# Altium project DQLA-Q.PrjPcb
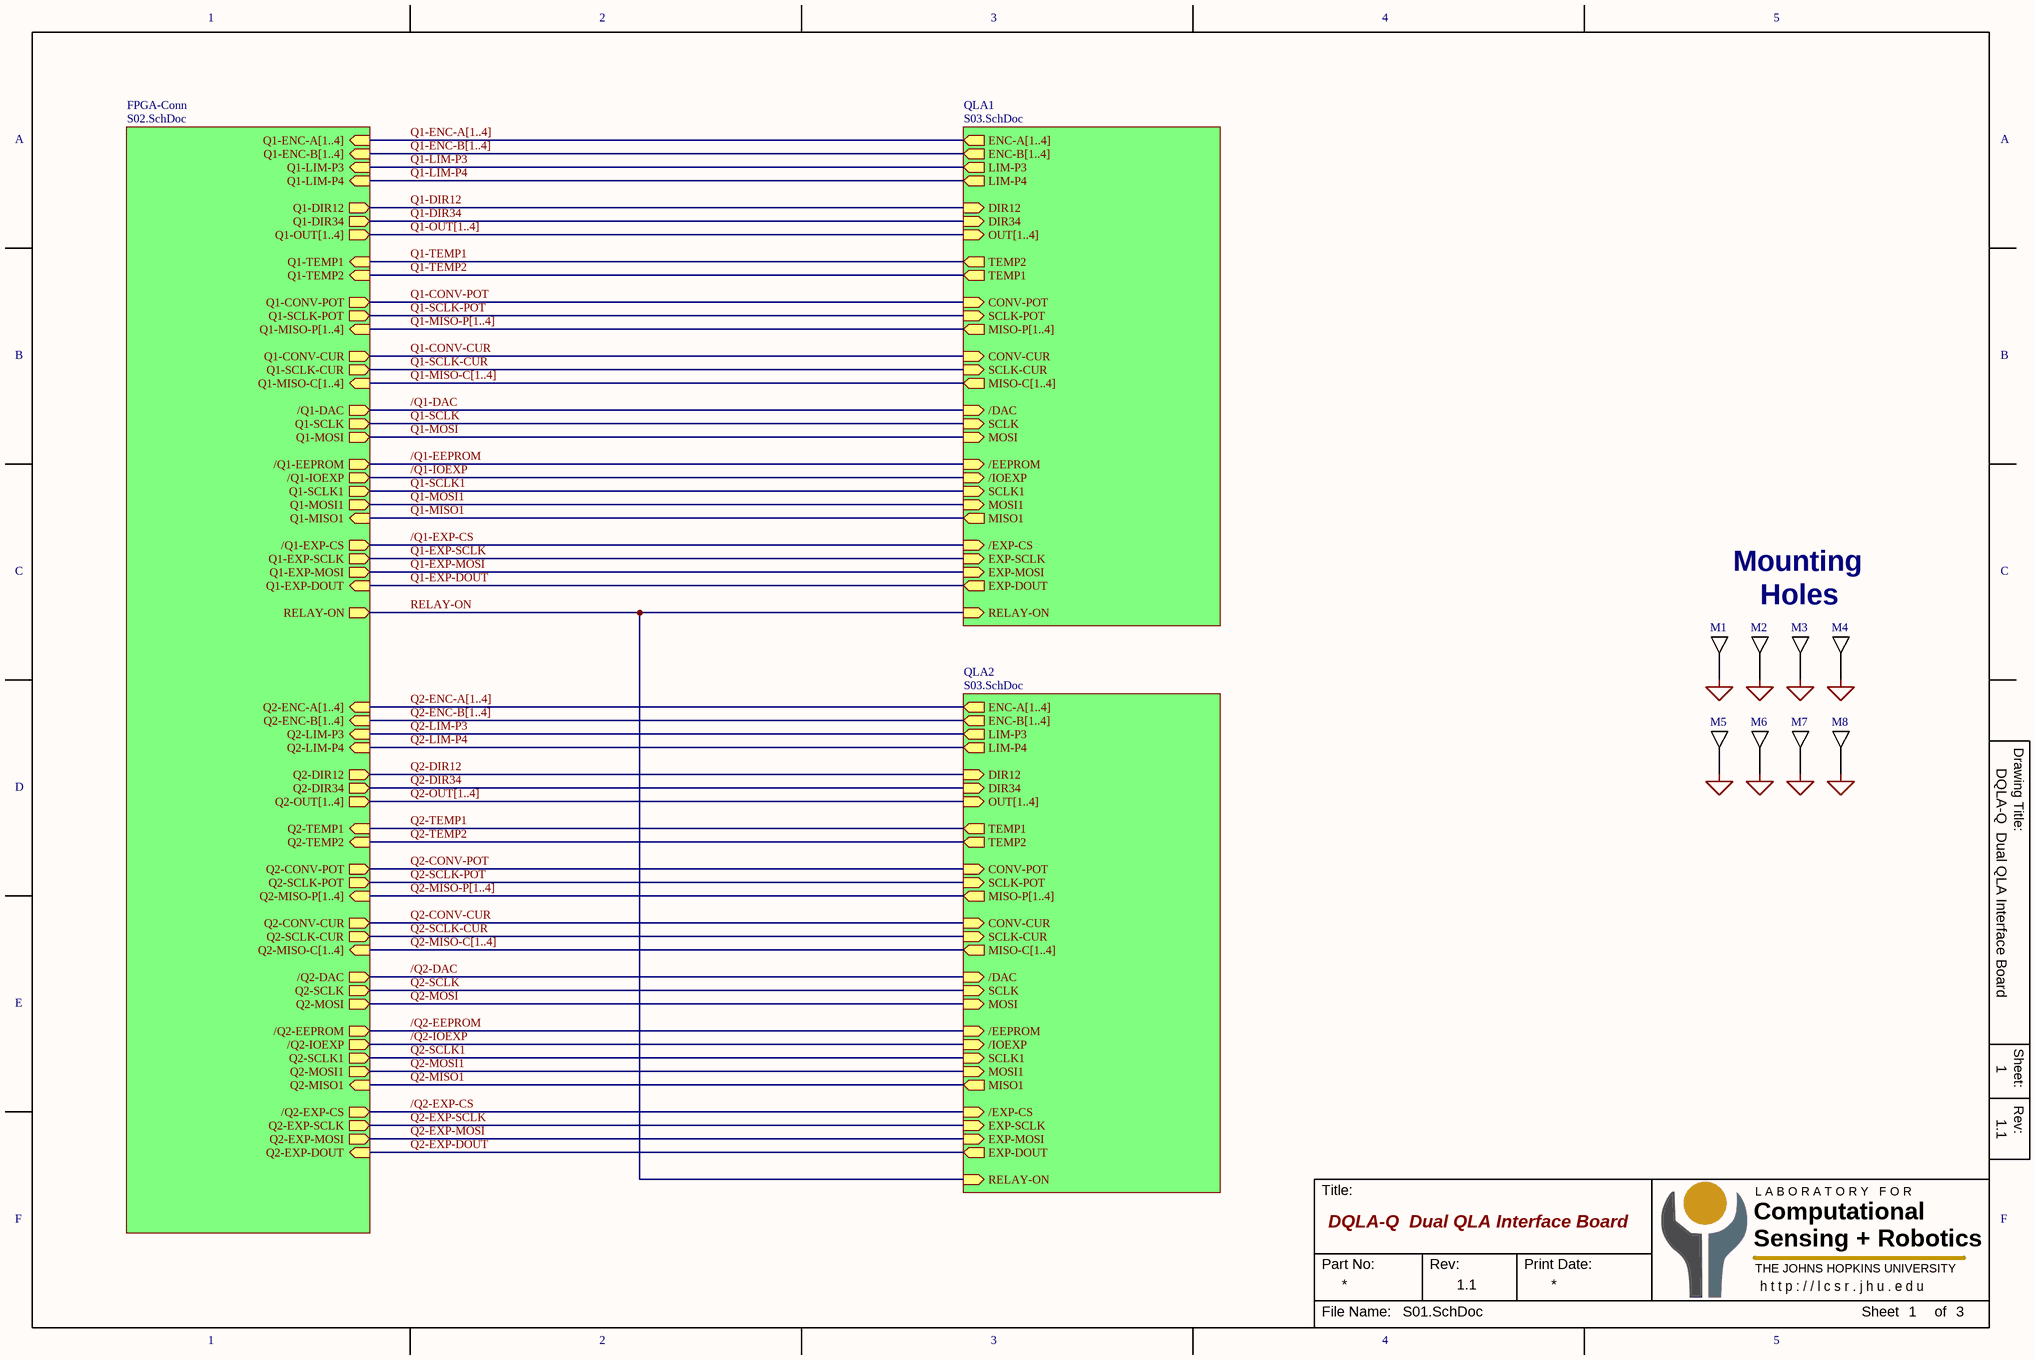
[diagram p0: S01.SchDoc]
3 sheets, 112 parts. Net scope: hierarchical (ports join the sheet entries above them; power ports are global).
Board file: DQLA-Q.PcbDoc
Sheets:
  S01.SchDoc
    FPGA-Conn = S02.SchDoc
    QLA1 = S03.SchDoc
    QLA2 = S03.SchDoc

## Sheet S01.SchDoc: DQLA-Q  Dual QLA Interface Board
size 381 x 254 mm; Revision: 1.1; SheetNumber: 1; SheetTotal: 3

### Parts
M1  MHOLE  [MHOLE4]  (value not drawn)  (no BOM)
M2  MHOLE  [MHOLE4]  (value not drawn)  (no BOM)
M3  MHOLE  [MHOLE4]  (value not drawn)  (no BOM)
M4  MHOLE  [MHOLE4]  (value not drawn)  (no BOM)
M5  MHOLE  [MHOLE4]  (value not drawn)  (no BOM)
M6  MHOLE  [MHOLE4]  (value not drawn)  (no BOM)
M7  MHOLE  [MHOLE4]  (value not drawn)  (no BOM)
M8  MHOLE  [MHOLE4]  (value not drawn)  (no BOM)

### Sub-sheets
FPGA-Conn = S02.SchDoc: Q2-DIR34 (out), Q1-CONV-CUR (out), /Q1-EXP-CS (out), /Q2-EXP-CS (out), Q2-LIM-P4 (in), Q1-DIR12 (out), Q1-LIM-P4 (in), Q1-SCLK-CUR (out), Q1-DIR34 (out), Q2-EXP-DOUT (in), Q1-MOSI1 (out), RELAY-ON (out), Q1-CONV-POT (out), Q1-SCLK-POT (out), Q2-DIR12 (out), Q2-OUT[1..4] (out), Q2-LIM-P3 (in), /Q1-DAC (out), Q1-MISO-P[1..4] (in), Q2-MISO-P[1..4] (in), Q1-LIM-P3 (in), Q1-TEMP2 (in), /Q1-IOEXP (out), /Q1-EEPROM (out), Q2-TEMP2 (in), Q2-TEMP1 (in), /Q2-DAC (out), /Q2-IOEXP (out), Q2-ENC-A[1..4] (in), Q1-MOSI (out), Q1-OUT[1..4] (out), Q1-MISO-C[1..4] (in), /Q2-EEPROM (out), Q2-MISO-C[1..4] (in), Q2-ENC-B[1..4] (in), Q1-ENC-B[1..4] (in), Q2-MOSI (out), Q1-EXP-DOUT (in), Q1-ENC-A[1..4] (in), Q1-TEMP1 (in), Q1-SCLK (out), Q2-CONV-POT (out), Q2-CONV-CUR (out), Q2-SCLK-CUR (out), Q2-SCLK-POT (out), Q2-MOSI1 (out), Q2-SCLK (out), Q2-SCLK1 (out), Q1-SCLK1 (out), Q2-MISO1 (in), Q1-MISO1 (in), Q1-EXP-SCLK (out), Q1-EXP-MOSI (out), Q2-EXP-SCLK (out), Q2-EXP-MOSI (out)
QLA1 = S03.SchDoc: ENC-A[1..4] (out), SCLK-POT (in), RELAY-ON (in), OUT[1..4] (in), EXP-DOUT (out), LIM-P3 (out), CONV-POT (in), ENC-B[1..4] (out), TEMP2 (out), TEMP1 (out), DIR12 (in), SCLK (in), MISO-P[1..4] (out), /EXP-CS (in), MOSI1 (in), EXP-MOSI (in), EXP-SCLK (in), /IOEXP (in), /EEPROM (in), SCLK1 (in), MISO1 (out), LIM-P4 (out), /DAC (in), DIR34 (in), CONV-CUR (in), SCLK-CUR (in), MOSI (in), MISO-C[1..4] (out)
QLA2 = S03.SchDoc: ENC-A[1..4] (out), SCLK-POT (in), RELAY-ON (in), OUT[1..4] (in), EXP-DOUT (out), LIM-P3 (out), CONV-POT (in), ENC-B[1..4] (out), TEMP2 (out), TEMP1 (out), DIR12 (in), SCLK (in), MISO-P[1..4] (out), /EXP-CS (in), MOSI1 (in), EXP-MOSI (in), EXP-SCLK (in), /IOEXP (in), /EEPROM (in), SCLK1 (in), MISO1 (out), LIM-P4 (out), /DAC (in), DIR34 (in), CONV-CUR (in), SCLK-CUR (in), MOSI (in), MISO-C[1..4] (out)

### Nets
GND: M1.1 M2.1 M3.1 M4.1 M5.1 M6.1 M7.1 M8.1
/Q1-DAC: sheet FPGA-Conn//Q1-DAC, sheet QLA1//DAC  [project net /DAC]
/Q1-EEPROM: sheet FPGA-Conn//Q1-EEPROM, sheet QLA1//EEPROM  [project net /EEPROM]
/Q1-EXP-CS: sheet FPGA-Conn//Q1-EXP-CS, sheet QLA1//EXP-CS  [project net /EXP-CS]
/Q1-IOEXP: sheet FPGA-Conn//Q1-IOEXP, sheet QLA1//IOEXP  [project net /IOEXP]
/Q2-DAC: sheet FPGA-Conn//Q2-DAC, sheet QLA2//DAC  [project net /DAC]
/Q2-EEPROM: sheet FPGA-Conn//Q2-EEPROM, sheet QLA2//EEPROM  [project net /EEPROM]
/Q2-EXP-CS: sheet FPGA-Conn//Q2-EXP-CS, sheet QLA2//EXP-CS  [project net /EXP-CS]
/Q2-IOEXP: sheet FPGA-Conn//Q2-IOEXP, sheet QLA2//IOEXP  [project net /IOEXP]
Q1-CONV-CUR: sheet FPGA-Conn/Q1-CONV-CUR, sheet QLA1/CONV-CUR  [project net CONV-CUR]
Q1-CONV-POT: sheet FPGA-Conn/Q1-CONV-POT, sheet QLA1/CONV-POT  [project net CONV-POT]
Q1-DIR12: sheet FPGA-Conn/Q1-DIR12, sheet QLA1/DIR12  [project net DIR12]
Q1-DIR34: sheet FPGA-Conn/Q1-DIR34, sheet QLA1/DIR34  [project net DIR34]
Q1-EXP-DOUT: sheet FPGA-Conn/Q1-EXP-DOUT, sheet QLA1/EXP-DOUT  [project net EXP-DOUT]
Q1-EXP-MOSI: sheet FPGA-Conn/Q1-EXP-MOSI, sheet QLA1/EXP-MOSI  [project net EXP-MOSI]
Q1-EXP-SCLK: sheet FPGA-Conn/Q1-EXP-SCLK, sheet QLA1/EXP-SCLK  [project net EXP-SCLK]
Q1-LIM-P3: sheet FPGA-Conn/Q1-LIM-P3, sheet QLA1/LIM-P3  [project net LIM-P3]
Q1-LIM-P4: sheet FPGA-Conn/Q1-LIM-P4, sheet QLA1/LIM-P4  [project net LIM-P4]
Q1-MISO1: sheet FPGA-Conn/Q1-MISO1, sheet QLA1/MISO1  [project net MISO1]
Q1-MOSI: sheet FPGA-Conn/Q1-MOSI, sheet QLA1/MOSI  [project net MOSI]
Q1-MOSI1: sheet FPGA-Conn/Q1-MOSI1, sheet QLA1/MOSI1  [project net MOSI1]
Q1-SCLK: sheet FPGA-Conn/Q1-SCLK, sheet QLA1/SCLK
Q1-SCLK1: sheet FPGA-Conn/Q1-SCLK1, sheet QLA1/SCLK1
Q1-SCLK-CUR: sheet FPGA-Conn/Q1-SCLK-CUR, sheet QLA1/SCLK-CUR
Q1-SCLK-POT: sheet FPGA-Conn/Q1-SCLK-POT, sheet QLA1/SCLK-POT
Q1-TEMP1: sheet FPGA-Conn/Q1-TEMP1, sheet QLA1/TEMP2
Q1-TEMP2: sheet FPGA-Conn/Q1-TEMP2, sheet QLA1/TEMP1
Q2-CONV-CUR: sheet FPGA-Conn/Q2-CONV-CUR, sheet QLA2/CONV-CUR  [project net CONV-CUR]
Q2-CONV-POT: sheet FPGA-Conn/Q2-CONV-POT, sheet QLA2/CONV-POT  [project net CONV-POT]
Q2-DIR12: sheet FPGA-Conn/Q2-DIR12, sheet QLA2/DIR12  [project net DIR12]
Q2-DIR34: sheet FPGA-Conn/Q2-DIR34, sheet QLA2/DIR34  [project net DIR34]
Q2-EXP-DOUT: sheet FPGA-Conn/Q2-EXP-DOUT, sheet QLA2/EXP-DOUT  [project net EXP-DOUT]
Q2-EXP-MOSI: sheet FPGA-Conn/Q2-EXP-MOSI, sheet QLA2/EXP-MOSI  [project net EXP-MOSI]
Q2-EXP-SCLK: sheet FPGA-Conn/Q2-EXP-SCLK, sheet QLA2/EXP-SCLK  [project net EXP-SCLK]
Q2-LIM-P3: sheet FPGA-Conn/Q2-LIM-P3, sheet QLA2/LIM-P3  [project net LIM-P3]
Q2-LIM-P4: sheet FPGA-Conn/Q2-LIM-P4, sheet QLA2/LIM-P4  [project net LIM-P4]
Q2-MISO1: sheet FPGA-Conn/Q2-MISO1, sheet QLA2/MISO1  [project net MISO1]
Q2-MOSI: sheet FPGA-Conn/Q2-MOSI, sheet QLA2/MOSI  [project net MOSI]
Q2-MOSI1: sheet FPGA-Conn/Q2-MOSI1, sheet QLA2/MOSI1  [project net MOSI1]
Q2-SCLK: sheet FPGA-Conn/Q2-SCLK, sheet QLA2/SCLK
Q2-SCLK1: sheet FPGA-Conn/Q2-SCLK1, sheet QLA2/SCLK1
Q2-SCLK-CUR: sheet FPGA-Conn/Q2-SCLK-CUR, sheet QLA2/SCLK-CUR
Q2-SCLK-POT: sheet FPGA-Conn/Q2-SCLK-POT, sheet QLA2/SCLK-POT
Q2-TEMP1: sheet FPGA-Conn/Q2-TEMP1, sheet QLA2/TEMP1
Q2-TEMP2: sheet FPGA-Conn/Q2-TEMP2, sheet QLA2/TEMP2
RELAY-ON: sheet FPGA-Conn/RELAY-ON, sheet QLA1/RELAY-ON, sheet QLA2/RELAY-ON

### Buses and harness runs
bus Q1-ENC-A[1..4] = sheet FPGA-Conn/Q1-ENC-A[1..4] = sheet QLA1/ENC-A[1..4]
bus Q1-ENC-B[1..4] = sheet FPGA-Conn/Q1-ENC-B[1..4] = sheet QLA1/ENC-B[1..4]
bus Q1-MISO-C[1..4] = sheet FPGA-Conn/Q1-MISO-C[1..4] = sheet QLA1/MISO-C[1..4]
bus Q1-MISO-P[1..4] = sheet FPGA-Conn/Q1-MISO-P[1..4] = sheet QLA1/MISO-P[1..4]
bus Q1-OUT[1..4] = sheet FPGA-Conn/Q1-OUT[1..4] = sheet QLA1/OUT[1..4]
bus Q2-ENC-A[1..4] = sheet FPGA-Conn/Q2-ENC-A[1..4] = sheet QLA2/ENC-A[1..4]
bus Q2-ENC-B[1..4] = sheet FPGA-Conn/Q2-ENC-B[1..4] = sheet QLA2/ENC-B[1..4]
bus Q2-MISO-C[1..4] = sheet FPGA-Conn/Q2-MISO-C[1..4] = sheet QLA2/MISO-C[1..4]
bus Q2-MISO-P[1..4] = sheet FPGA-Conn/Q2-MISO-P[1..4] = sheet QLA2/MISO-P[1..4]
bus Q2-OUT[1..4] = sheet FPGA-Conn/Q2-OUT[1..4] = sheet QLA2/OUT[1..4]

### Notes on the sheet
- To do:
- Mounting
- Holes
- 1
- 2
- 3
- 4
- 5
- A
- B
- C
- Drawing Title:
- D
- E
- Sheet:
- Rev:
- F
- Title:
- Computational
- Sensing + Robotics
- L A B O R A T O R Y   F O R
- Part No:
- Print Date:
- THE JOHNS HOPKINS UNIVERSITY
- h t t p : / / l c s r . j h u . e d u
- File Name:
- Sheet
- of

### Library data of the parts
M1-M8 = MHOLE: Mounting Hole

## Sheet S02.SchDoc: DQLA-Q  Dual QLA Interface Board
size 381 x 254 mm; Revision: 1.1; SheetNumber: 2; SheetTotal: 3
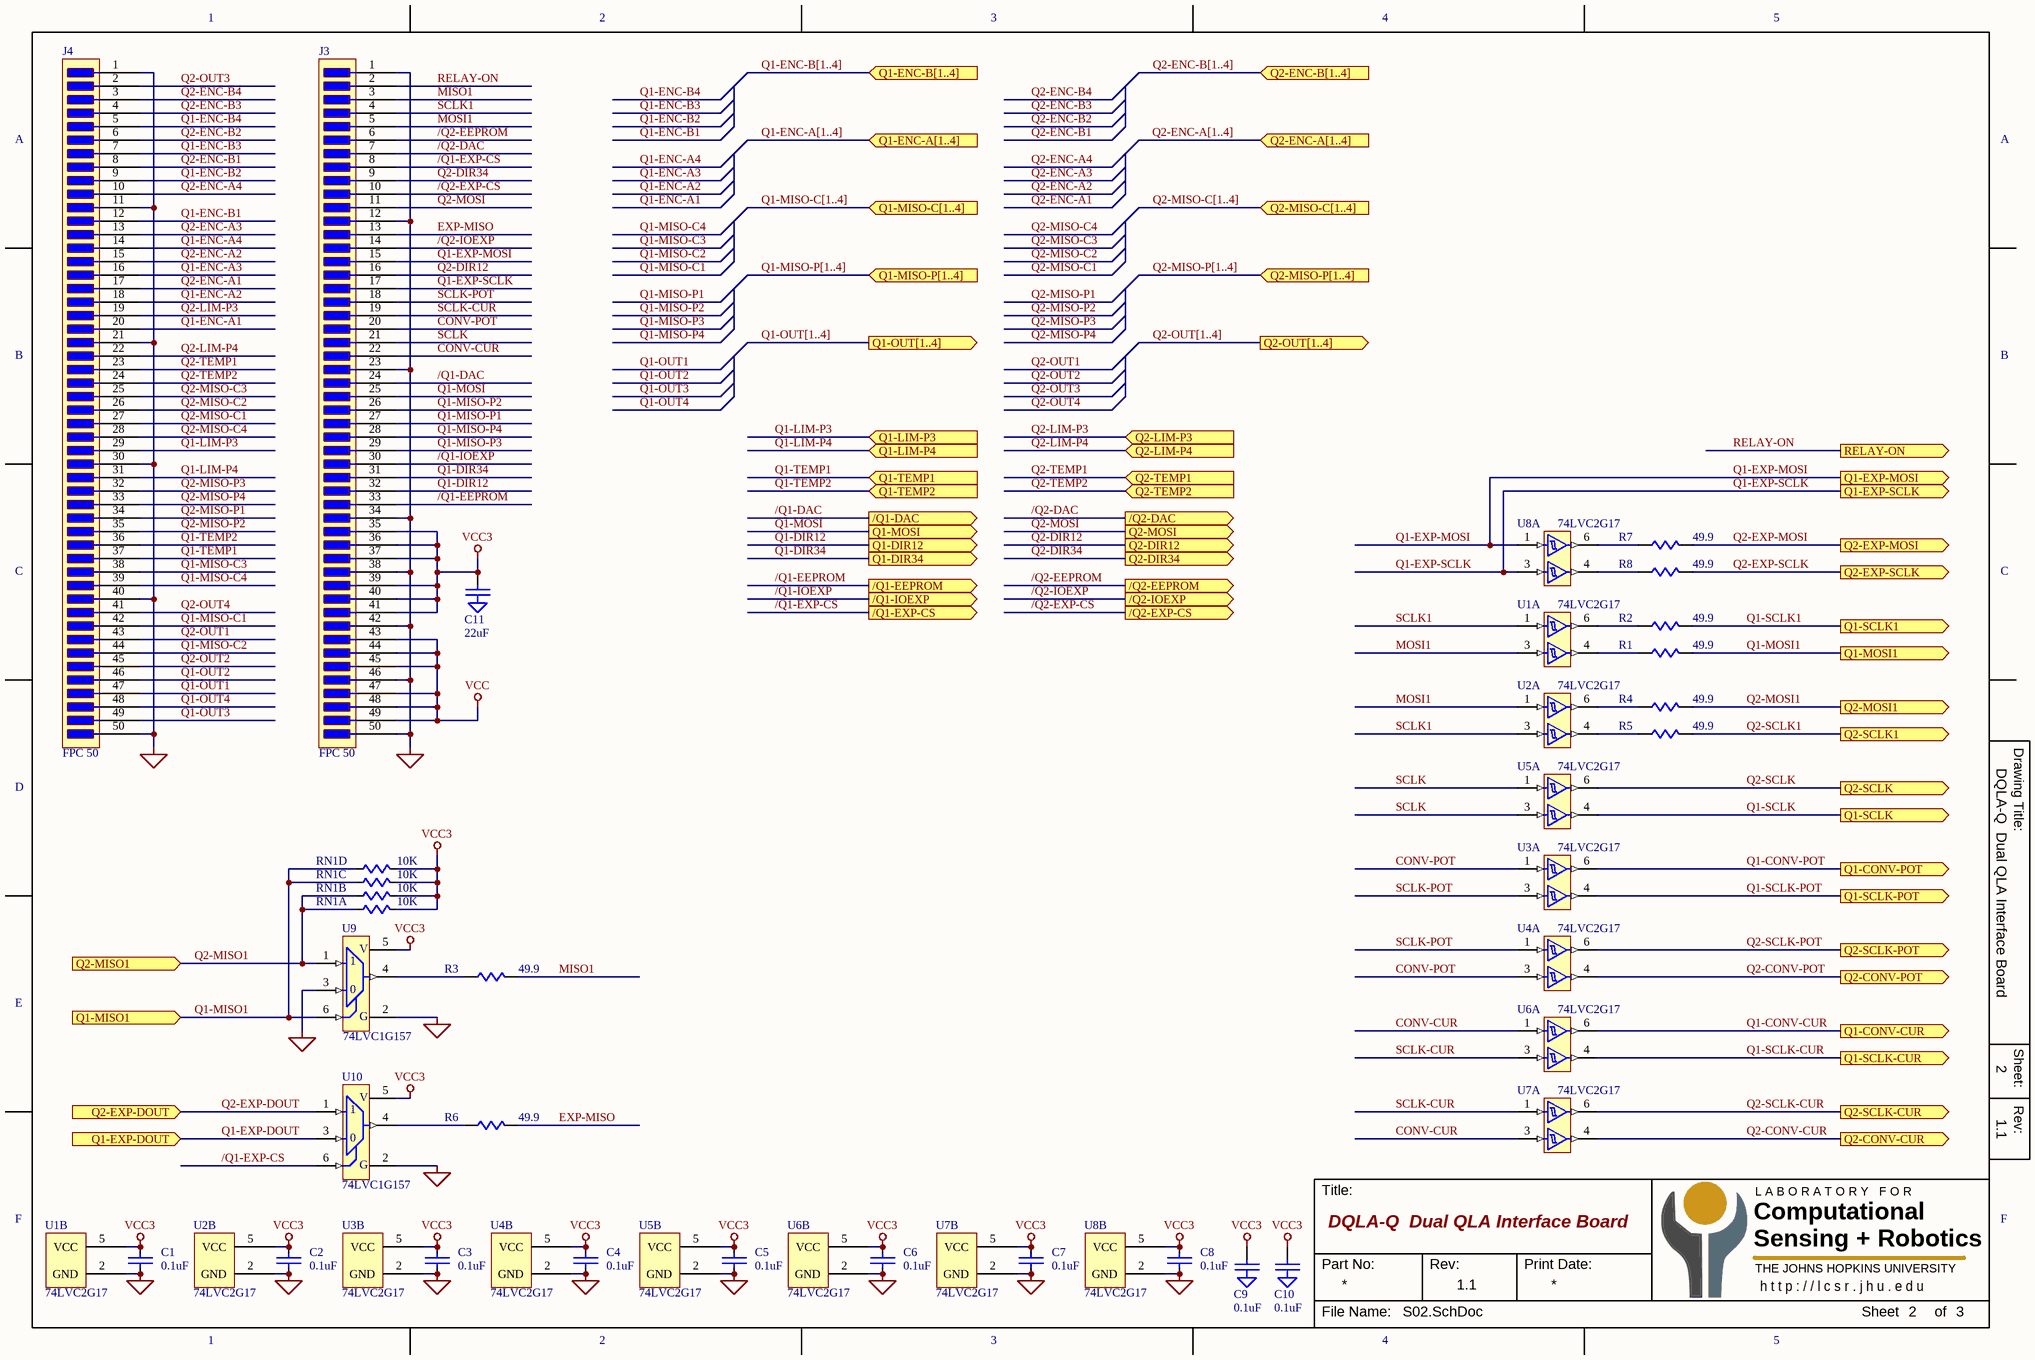
[diagram p1: S02.SchDoc]

### Parts
C1  0.1uF  [C0402]
C2  0.1uF  [C0402]
C3  0.1uF  [C0402]
C4  0.1uF  [C0402]
C5  0.1uF  [C0402]
C6  0.1uF  [C0402]
C7  0.1uF  [C0402]
C8  0.1uF  [C0402]
C9  0.1uF  [C0402]
C10  0.1uF  [C0402]
C11  22uF  [C0805]
J3  FPC 50  [CONN-XF3M1-5015-1B]
J4  FPC 50  [CONN-XF3M1-5015-1B]
R1  49.9  [R0402]
R2  49.9  [R0402]
R3  49.9  [R0402]
R4  49.9  [R0402]
R5  49.9  [R0402]
R6  49.9  [R0402]
R7  49.9  [R0402]
R8  49.9  [R0402]
RN1  10K  [RN-742C083]  (parts A,B,C,D of 4)
U1  74LVC2G17  [SC70-6]  (parts A,B of 2)
U2  74LVC2G17  [SC70-6]  (parts A,B of 2)
U3  74LVC2G17  [SC70-6]  (parts A,B of 2)
U4  74LVC2G17  [SC70-6]  (parts A,B of 2)
U5  74LVC2G17  [SC70-6]  (parts A,B of 2)
U6  74LVC2G17  [SC70-6]  (parts A,B of 2)
U7  74LVC2G17  [SC70-6]  (parts A,B of 2)
U8  74LVC2G17  [SC70-6]  (parts A,B of 2)
U9  74LVC1G157  [SC70-6]
U10  74LVC1G157  [SC70-6]

### Ports
/Q1-DAC (out), /Q1-EEPROM (out), /Q1-EXP-CS (out), /Q1-IOEXP (out), /Q2-DAC (out), /Q2-EEPROM (out), /Q2-EXP-CS (out), /Q2-IOEXP (out), Q1-CONV-CUR (out), Q1-CONV-POT (out), Q1-DIR12 (out), Q1-DIR34 (out), Q1-ENC-A[1..4] (in), Q1-ENC-B[1..4] (in), Q1-EXP-DOUT (in), Q1-EXP-MOSI (out), Q1-EXP-SCLK (out), Q1-LIM-P3 (in), Q1-LIM-P4 (in), Q1-MISO1 (in), Q1-MISO-C[1..4] (in), Q1-MISO-P[1..4] (in), Q1-MOSI1 (out), Q1-MOSI (out), Q1-OUT[1..4] (out), Q1-SCLK1 (out), Q1-SCLK (out), Q1-SCLK-CUR (out), Q1-SCLK-POT (out), Q1-TEMP1 (in), Q1-TEMP2 (in), Q2-CONV-CUR (out), Q2-CONV-POT (out), Q2-DIR12 (out), Q2-DIR34 (out), Q2-ENC-A[1..4] (in), Q2-ENC-B[1..4] (in), Q2-EXP-DOUT (in), Q2-EXP-MOSI (out), Q2-EXP-SCLK (out), Q2-LIM-P3 (in), Q2-LIM-P4 (in), Q2-MISO1 (in), Q2-MISO-C[1..4] (in), Q2-MISO-P[1..4] (in), Q2-MOSI1 (out), Q2-MOSI (out), Q2-OUT[1..4] (out), Q2-SCLK1 (out), Q2-SCLK (out), Q2-SCLK-CUR (out), Q2-SCLK-POT (out), Q2-TEMP1 (in), Q2-TEMP2 (in), RELAY-ON (out)

### Nets
GND: C1.2 C2.2 C3.2 C4.2 C5.2 C6.2 C7.2 C8.2 C9.2(GND) C10.2(GND) C11.2(GND) J3.1 J3.12 J3.23 J3.34 J3.38 J3.42 J3.46 J3.50 J4.1 J4.11 J4.21 J4.30 J4.40 J4.50 U1.2(GND) U2.2(GND) U3.2(GND) U4.2(GND) U5.2(GND) U6.2(GND) U7.2(GND) U8.2(GND) U9.2(-) U9.3 U10.2(-)
VCC: J3.43 J3.44 J3.45 J3.47 J3.48 J3.49
VCC3: C1.1 C2.1 C3.1 C4.1 C5.1 C6.1 C7.1 C8.1 C9.1 C10.1 C11.1 J3.35 J3.36 J3.37 J3.39 J3.40 J3.41 RN1.5 RN1.6 RN1.7 RN1.8 U1.5(VCC) U2.5(VCC) U3.5(VCC) U4.5(VCC) U5.5(VCC) U6.5(VCC) U7.5(VCC) U8.5(VCC) U9.5(+) U10.5(+)
/Q1-DAC: J3.24 ; port /Q1-DAC  [project net /DAC]
/Q1-EEPROM: J3.33 ; port /Q1-EEPROM  [project net /EEPROM]
/Q1-EXP-CS: J3.8 U10.6 ; port /Q1-EXP-CS  [project net /EXP-CS]
/Q1-IOEXP: J3.30 ; port /Q1-IOEXP  [project net /IOEXP]
/Q2-DAC: J3.7 ; port /Q2-DAC  [project net /DAC]
/Q2-EEPROM: J3.6 ; port /Q2-EEPROM  [project net /EEPROM]
/Q2-EXP-CS: J3.10 ; port /Q2-EXP-CS  [project net /EXP-CS]
/Q2-IOEXP: J3.14 ; port /Q2-IOEXP  [project net /IOEXP]
CONV-CUR: J3.22 U6.1 U7.3
CONV-POT: J3.20 U3.1 U4.3
EXP-MISO: J3.13 R6.2
MISO1: J3.3 R3.2
MOSI1: J3.5 U1.3 U2.1
Q1-CONV-CUR: U6.6 ; port Q1-CONV-CUR  [project net CONV-CUR]
Q1-CONV-POT: U3.6 ; port Q1-CONV-POT  [project net CONV-POT]
Q1-DIR12: J3.32 ; port Q1-DIR12  [project net DIR12]
Q1-DIR34: J3.31 ; port Q1-DIR34  [project net DIR34]
Q1-ENC-A1: J4.20  [project net ENC-A1]
Q1-ENC-A2: J4.18  [project net ENC-A2]
Q1-ENC-A3: J4.16  [project net ENC-A3]
Q1-ENC-A4: J4.14  [project net ENC-A4]
Q1-ENC-B1: J4.12  [project net ENC-B1]
Q1-ENC-B2: J4.9  [project net ENC-B2]
Q1-ENC-B3: J4.7  [project net ENC-B3]
Q1-ENC-B4: J4.5  [project net ENC-B4]
Q1-EXP-DOUT: U10.3 ; port Q1-EXP-DOUT  [project net EXP-DOUT]
Q1-EXP-MOSI: J3.15 U8.1 ; port Q1-EXP-MOSI  [project net EXP-MOSI]
Q1-EXP-SCLK: J3.17 U8.3 ; port Q1-EXP-SCLK  [project net EXP-SCLK]
Q1-LIM-P3: J4.29 ; port Q1-LIM-P3  [project net LIM-P3]
Q1-LIM-P4: J4.31 ; port Q1-LIM-P4  [project net LIM-P4]
Q1-MISO1: RN1.3 RN1.4 U9.6 ; port Q1-MISO1  [project net MISO1]
Q1-MISO-C1: J4.42  [project net MISO-C1]
Q1-MISO-C2: J4.44  [project net MISO-C2]
Q1-MISO-C3: J4.38  [project net MISO-C3]
Q1-MISO-C4: J4.39  [project net MISO-C4]
Q1-MISO-P1: J3.27  [project net MISO-P1]
Q1-MISO-P2: J3.26  [project net MISO-P2]
Q1-MISO-P3: J3.29  [project net MISO-P3]
Q1-MISO-P4: J3.28  [project net MISO-P4]
Q1-MOSI: J3.25 ; port Q1-MOSI  [project net MOSI]
Q1-MOSI1: R1.2 ; port Q1-MOSI1  [project net MOSI1]
Q1-OUT1: J4.47  [project net OUT1]
Q1-OUT2: J4.46  [project net OUT2]
Q1-OUT3: J4.49  [project net OUT3]
Q1-OUT4: J4.48  [project net OUT4]
Q1-SCLK: U5.4 ; port Q1-SCLK
Q1-SCLK1: R2.2 ; port Q1-SCLK1
Q1-SCLK-CUR: U6.4 ; port Q1-SCLK-CUR
Q1-SCLK-POT: U3.4 ; port Q1-SCLK-POT
Q1-TEMP1: J4.37 ; port Q1-TEMP1
Q1-TEMP2: J4.36 ; port Q1-TEMP2
Q2-CONV-CUR: U7.4 ; port Q2-CONV-CUR  [project net CONV-CUR]
Q2-CONV-POT: U4.4 ; port Q2-CONV-POT  [project net CONV-POT]
Q2-DIR12: J3.16 ; port Q2-DIR12  [project net DIR12]
Q2-DIR34: J3.9 ; port Q2-DIR34  [project net DIR34]
Q2-ENC-A1: J4.17  [project net ENC-A1]
Q2-ENC-A2: J4.15  [project net ENC-A2]
Q2-ENC-A3: J4.13  [project net ENC-A3]
Q2-ENC-A4: J4.10  [project net ENC-A4]
Q2-ENC-B1: J4.8  [project net ENC-B1]
Q2-ENC-B2: J4.6  [project net ENC-B2]
Q2-ENC-B3: J4.4  [project net ENC-B3]
Q2-ENC-B4: J4.3  [project net ENC-B4]
Q2-EXP-DOUT: U10.1 ; port Q2-EXP-DOUT  [project net EXP-DOUT]
Q2-EXP-MOSI: R7.2 ; port Q2-EXP-MOSI  [project net EXP-MOSI]
Q2-EXP-SCLK: R8.2 ; port Q2-EXP-SCLK  [project net EXP-SCLK]
Q2-LIM-P3: J4.19 ; port Q2-LIM-P3  [project net LIM-P3]
Q2-LIM-P4: J4.22 ; port Q2-LIM-P4  [project net LIM-P4]
Q2-MISO1: RN1.1 RN1.2 U9.1 ; port Q2-MISO1  [project net MISO1]
Q2-MISO-C1: J4.27  [project net MISO-C1]
Q2-MISO-C2: J4.26  [project net MISO-C2]
Q2-MISO-C3: J4.25  [project net MISO-C3]
Q2-MISO-C4: J4.28  [project net MISO-C4]
Q2-MISO-P1: J4.34  [project net MISO-P1]
Q2-MISO-P2: J4.35  [project net MISO-P2]
Q2-MISO-P3: J4.32  [project net MISO-P3]
Q2-MISO-P4: J4.33  [project net MISO-P4]
Q2-MOSI: J3.11 ; port Q2-MOSI  [project net MOSI]
Q2-MOSI1: R4.2 ; port Q2-MOSI1  [project net MOSI1]
Q2-OUT1: J4.43  [project net OUT1]
Q2-OUT2: J4.45  [project net OUT2]
Q2-OUT3: J4.2  [project net OUT3]
Q2-OUT4: J4.41  [project net OUT4]
Q2-SCLK: U5.6 ; port Q2-SCLK
Q2-SCLK1: R5.2 ; port Q2-SCLK1
Q2-SCLK-CUR: U7.6 ; port Q2-SCLK-CUR
Q2-SCLK-POT: U4.6 ; port Q2-SCLK-POT
Q2-TEMP1: J4.23 ; port Q2-TEMP1
Q2-TEMP2: J4.24 ; port Q2-TEMP2
RELAY-ON: J3.2 ; port RELAY-ON
SCLK: J3.21 U5.1 U5.3
SCLK1: J3.4 U1.1 U2.3
SCLK-CUR: J3.19 U6.3 U7.1
SCLK-POT: J3.18 U3.3 U4.1
NetR1_1: R1.1 U1.4
NetR2_1: R2.1 U1.6
NetR3_1: R3.1 U9.4
NetR4_1: R4.1 U2.6
NetR5_1: R5.1 U2.4
NetR6_1: R6.1 U10.4
NetR7_1: R7.1 U8.6
NetR8_1: R8.1 U8.4

### Buses and harness runs
bus Q1-ENC-A[1..4] = port Q1-ENC-A[1..4]
bus Q1-ENC-B[1..4] = port Q1-ENC-B[1..4]
bus Q1-MISO-C[1..4] = port Q1-MISO-C[1..4]
bus Q1-MISO-P[1..4] = port Q1-MISO-P[1..4]
bus Q1-OUT[1..4] = port Q1-OUT[1..4]
bus Q2-ENC-A[1..4] = port Q2-ENC-A[1..4]
bus Q2-ENC-B[1..4] = port Q2-ENC-B[1..4]
bus Q2-MISO-C[1..4] = port Q2-MISO-C[1..4]
bus Q2-MISO-P[1..4] = port Q2-MISO-P[1..4]
bus Q2-OUT[1..4] = port Q2-OUT[1..4]

### Notes on the sheet
- 1
- 2
- 3
- 4
- 5
- A
- B
- C
- Drawing Title:
- D
- E
- Sheet:
- Rev:
- F
- Title:
- Computational
- Sensing + Robotics
- L A B O R A T O R Y   F O R
- Part No:
- Print Date:
- THE JOHNS HOPKINS UNIVERSITY
- h t t p : / / l c s r . j h u . e d u
- File Name:
- Sheet
- of
- (in symbol 1G157) V; 0; G

### Library data of the parts
C1-C8 = CAP
C9-C11 = CAP-GND
R1-R8 = R
RN1 = RN-DISC-SM-4X
U1-U8 = 2G17-2: NC7WZ17
U9 U10 = 1G157

## Sheet S03.SchDoc: DQLA-Q  Dual QLA Interface Board
size 381 x 254 mm; Revision: 1.1; SheetNumber: 3; SheetTotal: 3
Used 2 times, as channels QLA1, QLA2. Parts and nets are listed once, with the designators drawn on the sheet.
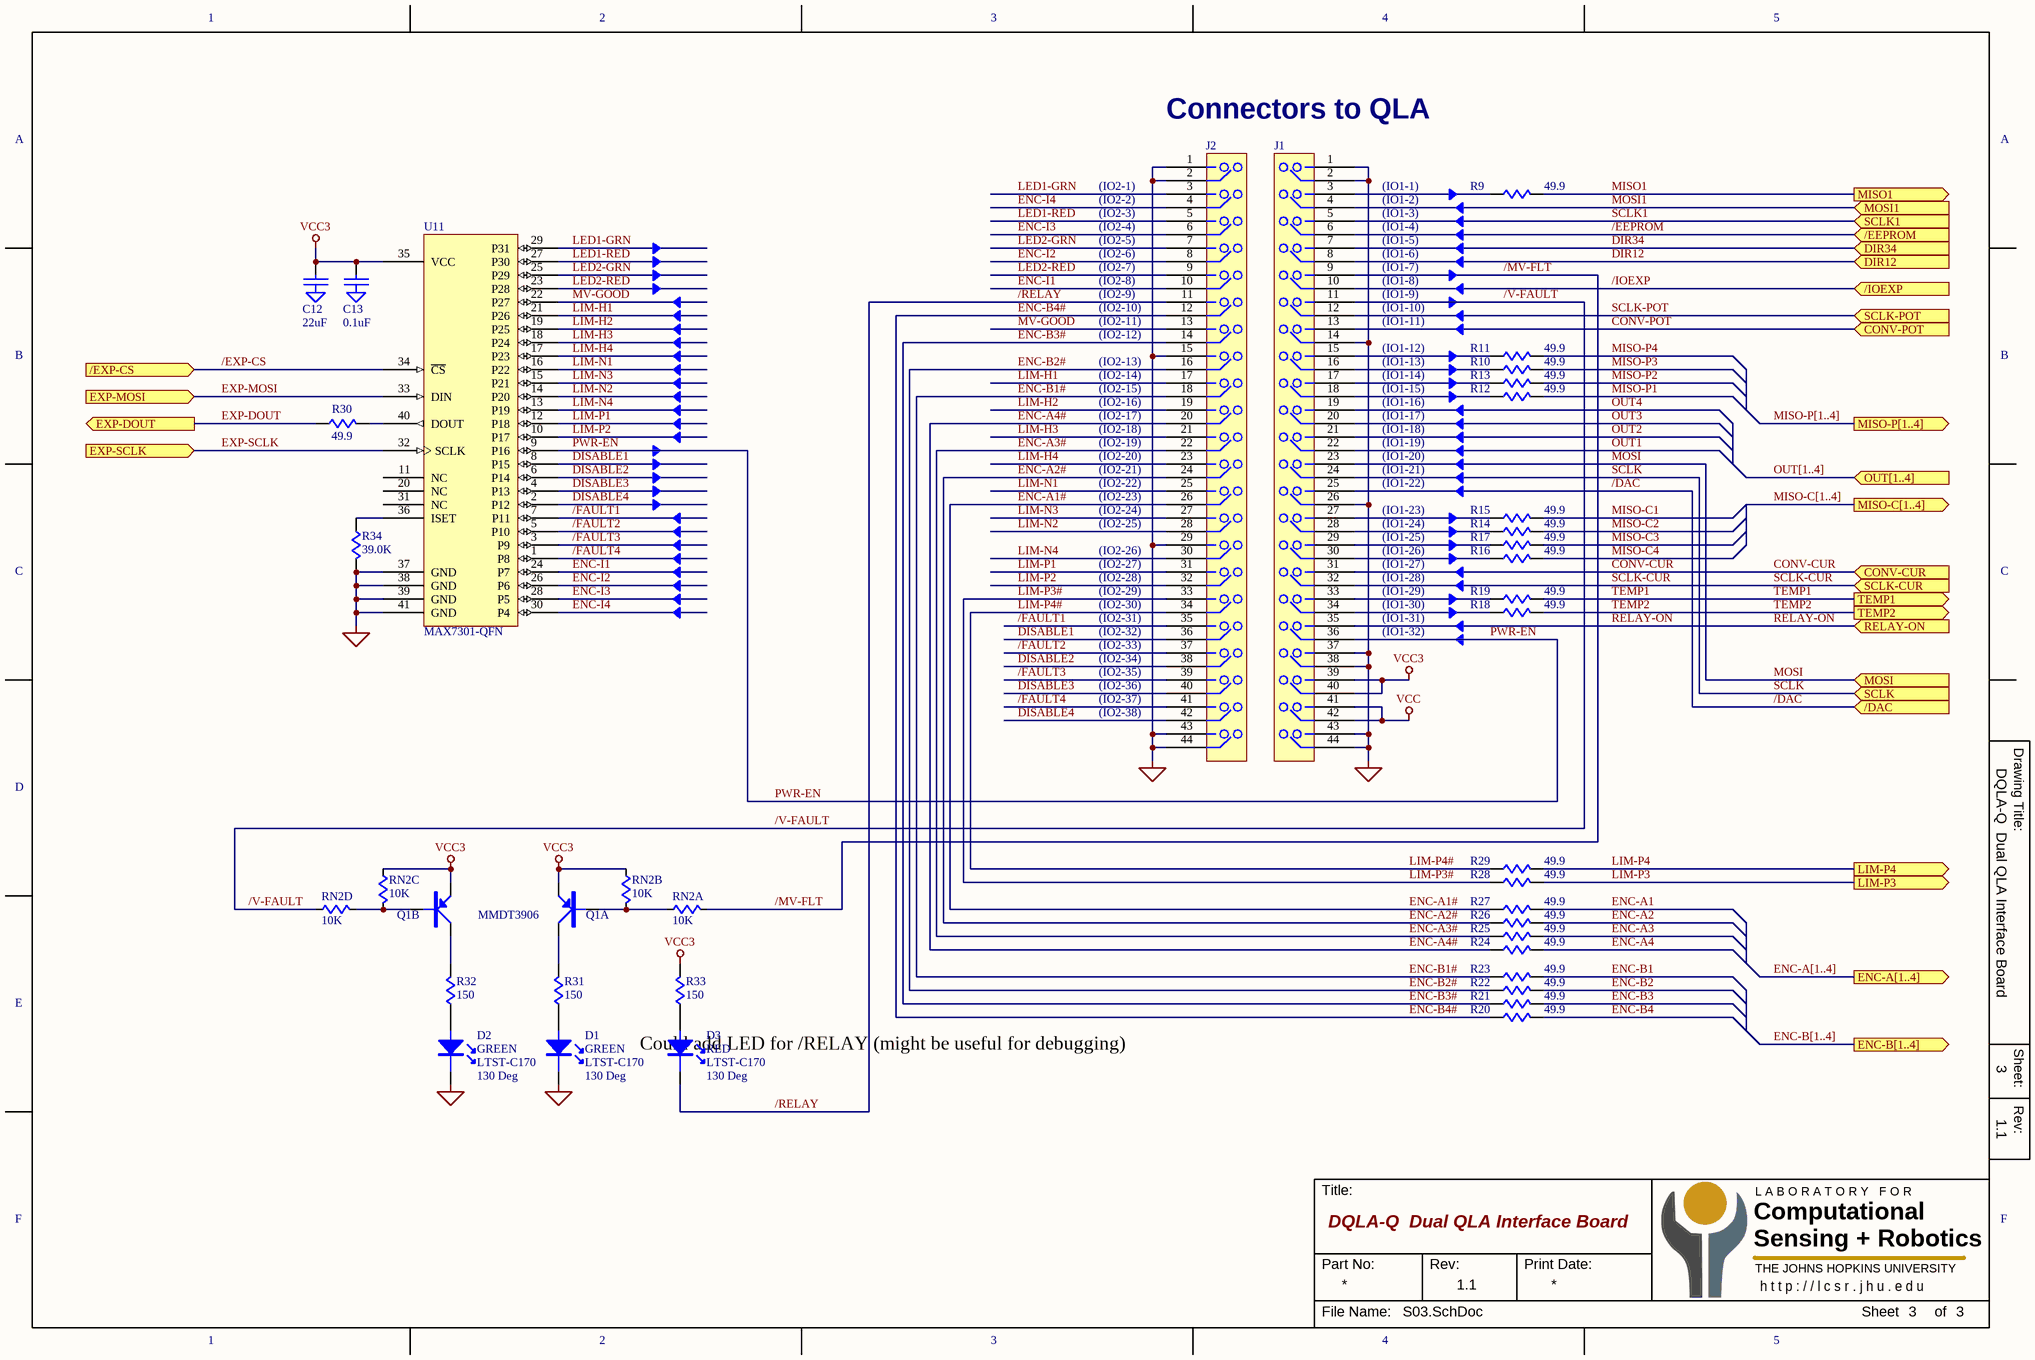
[diagram p2: S03.SchDoc]

### Parts
C12  22uF  [C0805]
C13  0.1uF  [C0402]
D1  Color: GREEN  P/N: LTST-C170  Angle: 130 Deg  [LED-0805]  (hidden comment: LED)
D2  Color: GREEN  P/N: LTST-C170  Angle: 130 Deg  [LED-0805]  (hidden comment: LED)
D3  Color: RED  P/N: LTST-C170  Angle: 130 Deg  [LED-0805]  (hidden comment: LED)
J1  HEADER 22x2-1  [HDR-22x2-2MM]  (value not drawn)
J2  HEADER 22x2-1  [HDR-22x2-2MM]  (value not drawn)
Q1  MMDT3906  [SC70-6-NP]  (parts A,B of 2)
R9  49.9  [R0402]
R10  49.9  [R0402]
R11  49.9  [R0402]
R12  49.9  [R0402]
R13  49.9  [R0402]
R14  49.9  [R0402]
R15  49.9  [R0402]
R16  49.9  [R0402]
R17  49.9  [R0402]
R18  49.9  [R0402]
R19  49.9  [R0402]
R20  49.9  [R0402]
R21  49.9  [R0402]
R22  49.9  [R0402]
R23  49.9  [R0402]
R24  49.9  [R0402]
R25  49.9  [R0402]
R26  49.9  [R0402]
R27  49.9  [R0402]
R28  49.9  [R0402]
R29  49.9  [R0402]
R30  49.9  [R0402]
R31  150  [R0603]
R32  150  [R0603]
R33  150  [R0603]
R34  39.0K  [R0402]
RN2  10K  [RN-742C083]  (parts A,B,C,D of 4)
U11  MAX7301-QFN  [QFN-40-6mm]

### Ports
/DAC (in), /EEPROM (in), /EXP-CS (in), /IOEXP (in), CONV-CUR (in), CONV-POT (in), DIR12 (in), DIR34 (in), ENC-A[1..4] (out), ENC-B[1..4] (out), EXP-DOUT (out), EXP-MOSI (in), EXP-SCLK (in), LIM-P3 (out), LIM-P4 (out), MISO1 (out), MISO-C[1..4] (out), MISO-P[1..4] (out), MOSI1 (in), MOSI (in), OUT[1..4] (in), RELAY-ON (in), SCLK1 (in), SCLK (in), SCLK-CUR (in), SCLK-POT (in), TEMP1 (out), TEMP2 (out)

### Nets
GND: C12.2(GND) C13.2(GND) D1.1(C) D2.1(C) J1.1 J1.2 J1.14 J1.26 J1.37 J1.38 J1.43 J1.44 J2.1 J2.2 J2.15 J2.29 J2.43 J2.44 R34.2 U11.37(GND) U11.38(GND) U11.39(GND) U11.41(GND)
VCC: J1.41 J1.42
VCC3: C12.1 C13.1 J1.39 J1.40 Q1.1(E) Q1.4(E) R33.2 RN2.2 RN2.3 U11.35(VCC)
/DAC: J1.25 ; port /DAC
/EEPROM: J1.6 ; port /EEPROM
/EXP-CS: U11.34(~{CS}) ; port /EXP-CS
/FAULT1: J2.35 U11.7(P11)
/FAULT2: J2.37 U11.5(P10)
/FAULT3: J2.39 U11.3(P9)
/FAULT4: J2.41 U11.1(P8)
/IOEXP: J1.10 ; port /IOEXP
/MV-FLT: J1.9 RN2.1
/RELAY: D3.1(C) J2.11
/V-FAULT: J1.11 RN2.4
CONV-CUR: J1.31 ; port CONV-CUR
CONV-POT: J1.13 ; port CONV-POT
DIR12: J1.8 ; port DIR12
DIR34: J1.7 ; port DIR34
DISABLE1: J2.36 U11.8(P15)
DISABLE2: J2.38 U11.6(P14)
DISABLE3: J2.40 U11.4(P13)
DISABLE4: J2.42 U11.2(P12)
ENC-A1: R27.2
ENC-A1#: J2.26 R27.1
ENC-A2: R26.2
ENC-A2#: J2.24 R26.1
ENC-A3: R25.2
ENC-A3#: J2.22 R25.1
ENC-A4: R24.2
ENC-A4#: J2.20 R24.1
ENC-B1: R23.2
ENC-B1#: J2.18 R23.1
ENC-B2: R22.2
ENC-B2#: J2.16 R22.1
ENC-B3: R21.2
ENC-B3#: J2.14 R21.1
ENC-B4: R20.2
ENC-B4#: J2.12 R20.1
ENC-I1: J2.10 U11.24(P7)
ENC-I2: J2.8 U11.26(P6)
ENC-I3: J2.6 U11.28(P5)
ENC-I4: J2.4 U11.30(P4)
EXP-DOUT: R30.1 ; port EXP-DOUT
EXP-MOSI: U11.33(DIN) ; port EXP-MOSI
EXP-SCLK: U11.32(SCLK) ; port EXP-SCLK
LED1-GRN: J2.3 U11.29(P31)
LED1-RED: J2.5 U11.27(P30)
LED2-GRN: J2.7 U11.25(P29)
LED2-RED: J2.9 U11.23(P28)
LIM-H1: J2.17 U11.21(P26)
LIM-H2: J2.19 U11.19(P25)
LIM-H3: J2.21 U11.18(P24)
LIM-H4: J2.23 U11.17(P23)
LIM-N1: J2.25 U11.16(P22)
LIM-N2: J2.28 U11.14(P20)
LIM-N3: J2.27 U11.15(P21)
LIM-N4: J2.30 U11.13(P19)
LIM-P1: J2.31 U11.12(P18)
LIM-P2: J2.32 U11.10(P17)
LIM-P3: R28.2 ; port LIM-P3
LIM-P3#: J2.33 R28.1
LIM-P4: R29.2 ; port LIM-P4
LIM-P4#: J2.34 R29.1
MISO1: R9.2 ; port MISO1
MISO-C1: R15.2
MISO-C2: R14.2
MISO-C3: R17.2
MISO-C4: R16.2
MISO-P1: R12.2
MISO-P2: R13.2
MISO-P3: R10.2
MISO-P4: R11.2
MOSI: J1.23 ; port MOSI
MOSI1: J1.4 ; port MOSI1
MV-GOOD: J2.13 U11.22(P27)
OUT1: J1.22
OUT2: J1.21
OUT3: J1.20
OUT4: J1.19
PWR-EN: J1.36 U11.9(P16)
RELAY-ON: J1.35 ; port RELAY-ON
SCLK: J1.24 ; port SCLK
SCLK1: J1.5 ; port SCLK1
SCLK-CUR: J1.32 ; port SCLK-CUR
SCLK-POT: J1.12 ; port SCLK-POT
TEMP1: R19.2 ; port TEMP1
TEMP2: R18.2 ; port TEMP2
NetD1_2: D1.2(A) R31.1
NetD2_2: D2.2(A) R32.1
NetD3_2: D3.2(A) R33.1
NetJ1_3: J1.3 R9.1
NetJ1_15: J1.15 R11.1
NetJ1_16: J1.16 R10.1
NetJ1_17: J1.17 R13.1
NetJ1_18: J1.18 R12.1
NetJ1_27: J1.27 R15.1
NetJ1_28: J1.28 R14.1
NetJ1_29: J1.29 R17.1
NetJ1_30: J1.30 R16.1
NetJ1_33: J1.33 R19.1
NetJ1_34: J1.34 R18.1
NetQ1_2: Q1.2(B) RN2.7 RN2.8
NetQ1_3: Q1.3(C) R32.2
NetQ1_5: Q1.5(B) RN2.5 RN2.6
NetQ1_6: Q1.6(C) R31.2
NetR30_2: R30.2 U11.40(DOUT)
NetR34_1: R34.1 U11.36(ISET)

Not connected (* = marked no-connect by the designer): U11 11(NC) 20(NC) 31(NC)

### Channels
QLA1: designators end in _QLA1; ports /DAC=/DAC /EEPROM=/EEPROM /EXP-CS=/EXP-CS /IOEXP=/IOEXP CONV-CUR=CONV-CUR CONV-POT=CONV-POT DIR12=DIR12 DIR34=DIR34 EXP-DOUT=EXP-DOUT EXP-MOSI=EXP-MOSI EXP-SCLK=EXP-SCLK LIM-P3=LIM-P3 LIM-P4=LIM-P4 MISO1=MISO1 MOSI1=MOSI1 MOSI=MOSI RELAY-ON=RELAY-ON SCLK1=Q1-SCLK1 SCLK-CUR=Q1-SCLK-CUR SCLK-POT=Q1-SCLK-POT SCLK=Q1-SCLK TEMP1=Q1-TEMP2 TEMP2=Q1-TEMP1
QLA2: designators end in _QLA2; ports /DAC=/DAC /EEPROM=/EEPROM /EXP-CS=/EXP-CS /IOEXP=/IOEXP CONV-CUR=CONV-CUR CONV-POT=CONV-POT DIR12=DIR12 DIR34=DIR34 EXP-DOUT=EXP-DOUT EXP-MOSI=EXP-MOSI EXP-SCLK=EXP-SCLK LIM-P3=LIM-P3 LIM-P4=LIM-P4 MISO1=MISO1 MOSI1=MOSI1 MOSI=MOSI RELAY-ON=RELAY-ON SCLK1=Q2-SCLK1 SCLK-CUR=Q2-SCLK-CUR SCLK-POT=Q2-SCLK-POT SCLK=Q2-SCLK TEMP1=Q2-TEMP1 TEMP2=Q2-TEMP2

### Buses and harness runs
bus ENC-A[1..4] = port ENC-A[1..4]
bus ENC-B[1..4] = port ENC-B[1..4]
bus MISO-C[1..4] = port MISO-C[1..4]
bus MISO-P[1..4] = port MISO-P[1..4]
bus OUT[1..4] = port OUT[1..4]

### Notes on the sheet
- Connectors to QLA
- (IO2-1)
- (IO2-2)
- (IO2-3)
- (IO2-4)
- (IO1-1)
- (IO1-2)
- (IO1-3)
- (IO1-4)
- (IO2-5)
- (IO2-6)
- (IO2-7)
- (IO2-8)
- (IO2-9)
- (IO1-5)
- (IO1-6)
- (IO1-7)
- (IO1-8)
- (IO1-9)
- (IO2-10)
- (IO2-11)
- (IO2-12)
- (IO2-13)
- (IO1-10)
- (IO1-11)
- (IO1-12)
- (IO1-13)
- (IO2-14)
- (IO2-15)
- (IO2-16)
- (IO2-17)
- (IO2-18)
- (IO1-14)
- (IO1-15)
- (IO1-16)
- (IO1-17)
- (IO1-18)
- (IO2-19)
- (IO2-20)
- (IO2-21)
- (IO2-22)
- (IO2-23)
- (IO1-19)
- (IO1-20)
- (IO1-21)
- (IO1-22)
- (IO2-24)
- (IO2-25)
- (IO2-26)
- (IO2-27)
- (IO1-23)
- (IO1-24)
- (IO1-25)
- (IO1-26)
- (IO1-27)
- (IO2-28)
- (IO2-29)
- (IO2-30)
- (IO2-31)
- (IO2-32)
- (IO1-28)
- (IO1-29)
- (IO1-30)
- (IO1-31)
- (IO1-32)
- (IO2-33)
- (IO2-34)
- (IO2-35)
- (IO2-36)
- (IO2-37)
- (IO2-38)
- Could add LED for /RELAY (might be useful for debugging)
- (near D3) Could add LED for /RELAY (might be useful for debugging)
- 1
- 2
- 3
- 4
- 5
- A
- B
- C
- Drawing Title:
- D
- E
- Sheet:
- Rev:
- F
- Title:
- Computational
- Sensing + Robotics
- L A B O R A T O R Y   F O R
- Part No:
- Print Date:
- THE JOHNS HOPKINS UNIVERSITY
- h t t p : / / l c s r . j h u . e d u
- File Name:
- Sheet
- of

### Library data of the parts
C12 C13 = CAP-GND
Q1 = PNP-DUAL-DIAG
R9-R34 = R
RN2 = RN-DISC-SM-4X

## Nets that join several sheets
GND: S01 (8 pins), S02 (36 pins), QLA1 (23 pins), QLA2 (23 pins)
VCC: S02 (6 pins), QLA1 (J1_QLA1.41 J1_QLA1.42), QLA2 (J1_QLA2.41 J1_QLA2.42)
VCC3: S02 (31 pins), QLA1 (10 pins), QLA2 (10 pins)
/DAC: S02 (J3.7), QLA2 (J1_QLA2.25)
/DAC: S02 (J3.24), QLA1 (J1_QLA1.25)
/EEPROM: S02 (J3.6), QLA2 (J1_QLA2.6)
/EEPROM: S02 (J3.33), QLA1 (J1_QLA1.6)
/EXP-CS: S02 (J3.8 U10.6), QLA1 (U11_QLA1.34)
/EXP-CS: S02 (J3.10), QLA2 (U11_QLA2.34)
/IOEXP: S02 (J3.14), QLA2 (J1_QLA2.10)
/IOEXP: S02 (J3.30), QLA1 (J1_QLA1.10)
CONV-CUR: S02 (U6.6), QLA1 (J1_QLA1.31)
CONV-CUR: S02 (U7.4), QLA2 (J1_QLA2.31)
CONV-POT: S02 (U3.6), QLA1 (J1_QLA1.13)
CONV-POT: S02 (U4.4), QLA2 (J1_QLA2.13)
DIR12: S02 (J3.16), QLA2 (J1_QLA2.8)
DIR12: S02 (J3.32), QLA1 (J1_QLA1.8)
DIR34: S02 (J3.9), QLA2 (J1_QLA2.7)
DIR34: S02 (J3.31), QLA1 (J1_QLA1.7)
ENC-A1: S02 (J4.17), QLA2 (R27_QLA2.2)
ENC-A1: S02 (J4.20), QLA1 (R27_QLA1.2)
ENC-A2: S02 (J4.15), QLA2 (R26_QLA2.2)
ENC-A2: S02 (J4.18), QLA1 (R26_QLA1.2)
ENC-A3: S02 (J4.13), QLA2 (R25_QLA2.2)
ENC-A3: S02 (J4.16), QLA1 (R25_QLA1.2)
ENC-A4: S02 (J4.10), QLA2 (R24_QLA2.2)
ENC-A4: S02 (J4.14), QLA1 (R24_QLA1.2)
ENC-B1: S02 (J4.8), QLA2 (R23_QLA2.2)
ENC-B1: S02 (J4.12), QLA1 (R23_QLA1.2)
ENC-B2: S02 (J4.6), QLA2 (R22_QLA2.2)
ENC-B2: S02 (J4.9), QLA1 (R22_QLA1.2)
ENC-B3: S02 (J4.4), QLA2 (R21_QLA2.2)
ENC-B3: S02 (J4.7), QLA1 (R21_QLA1.2)
ENC-B4: S02 (J4.3), QLA2 (R20_QLA2.2)
ENC-B4: S02 (J4.5), QLA1 (R20_QLA1.2)
EXP-DOUT: S02 (U10.1), QLA2 (R30_QLA2.1)
EXP-DOUT: S02 (U10.3), QLA1 (R30_QLA1.1)
EXP-MOSI: S02 (J3.15 U8.1), QLA1 (U11_QLA1.33)
EXP-MOSI: S02 (R7.2), QLA2 (U11_QLA2.33)
EXP-SCLK: S02 (J3.17 U8.3), QLA1 (U11_QLA1.32)
EXP-SCLK: S02 (R8.2), QLA2 (U11_QLA2.32)
LIM-P3: S02 (J4.19), QLA2 (R28_QLA2.2)
LIM-P3: S02 (J4.29), QLA1 (R28_QLA1.2)
LIM-P4: S02 (J4.22), QLA2 (R29_QLA2.2)
LIM-P4: S02 (J4.31), QLA1 (R29_QLA1.2)
MISO1: S02 (RN1.1 RN1.2 U9.1), QLA2 (R9_QLA2.2)
MISO1: S02 (RN1.3 RN1.4 U9.6), QLA1 (R9_QLA1.2)
MISO-C1: S02 (J4.27), QLA2 (R15_QLA2.2)
MISO-C1: S02 (J4.42), QLA1 (R15_QLA1.2)
MISO-C2: S02 (J4.26), QLA2 (R14_QLA2.2)
MISO-C2: S02 (J4.44), QLA1 (R14_QLA1.2)
MISO-C3: S02 (J4.25), QLA2 (R17_QLA2.2)
MISO-C3: S02 (J4.38), QLA1 (R17_QLA1.2)
MISO-C4: S02 (J4.28), QLA2 (R16_QLA2.2)
MISO-C4: S02 (J4.39), QLA1 (R16_QLA1.2)
MISO-P1: S02 (J3.27), QLA1 (R12_QLA1.2)
MISO-P1: S02 (J4.34), QLA2 (R12_QLA2.2)
MISO-P2: S02 (J3.26), QLA1 (R13_QLA1.2)
MISO-P2: S02 (J4.35), QLA2 (R13_QLA2.2)
MISO-P3: S02 (J3.29), QLA1 (R10_QLA1.2)
MISO-P3: S02 (J4.32), QLA2 (R10_QLA2.2)
MISO-P4: S02 (J3.28), QLA1 (R11_QLA1.2)
MISO-P4: S02 (J4.33), QLA2 (R11_QLA2.2)
MOSI: S02 (J3.11), QLA2 (J1_QLA2.23)
MOSI: S02 (J3.25), QLA1 (J1_QLA1.23)
MOSI1: S02 (R1.2), QLA1 (J1_QLA1.4)
MOSI1: S02 (R4.2), QLA2 (J1_QLA2.4)
OUT1: S02 (J4.43), QLA2 (J1_QLA2.22)
OUT1: S02 (J4.47), QLA1 (J1_QLA1.22)
OUT2: S02 (J4.45), QLA2 (J1_QLA2.21)
OUT2: S02 (J4.46), QLA1 (J1_QLA1.21)
OUT3: S02 (J4.2), QLA2 (J1_QLA2.20)
OUT3: S02 (J4.49), QLA1 (J1_QLA1.20)
OUT4: S02 (J4.41), QLA2 (J1_QLA2.19)
OUT4: S02 (J4.48), QLA1 (J1_QLA1.19)
Q1-SCLK: S02 (U5.4), QLA1 (J1_QLA1.24)
Q1-SCLK1: S02 (R2.2), QLA1 (J1_QLA1.5)
Q1-SCLK-CUR: S02 (U6.4), QLA1 (J1_QLA1.32)
Q1-SCLK-POT: S02 (U3.4), QLA1 (J1_QLA1.12)
Q1-TEMP1: S02 (J4.37), QLA1 (R18_QLA1.2)
Q1-TEMP2: S02 (J4.36), QLA1 (R19_QLA1.2)
Q2-SCLK: S02 (U5.6), QLA2 (J1_QLA2.24)
Q2-SCLK1: S02 (R5.2), QLA2 (J1_QLA2.5)
Q2-SCLK-CUR: S02 (U7.6), QLA2 (J1_QLA2.32)
Q2-SCLK-POT: S02 (U4.6), QLA2 (J1_QLA2.12)
Q2-TEMP1: S02 (J4.23), QLA2 (R19_QLA2.2)
Q2-TEMP2: S02 (J4.24), QLA2 (R18_QLA2.2)
RELAY-ON: S02 (J3.2), QLA1 (J1_QLA1.35), QLA2 (J1_QLA2.35)